# Altium project tinyCamera.PrjPcb
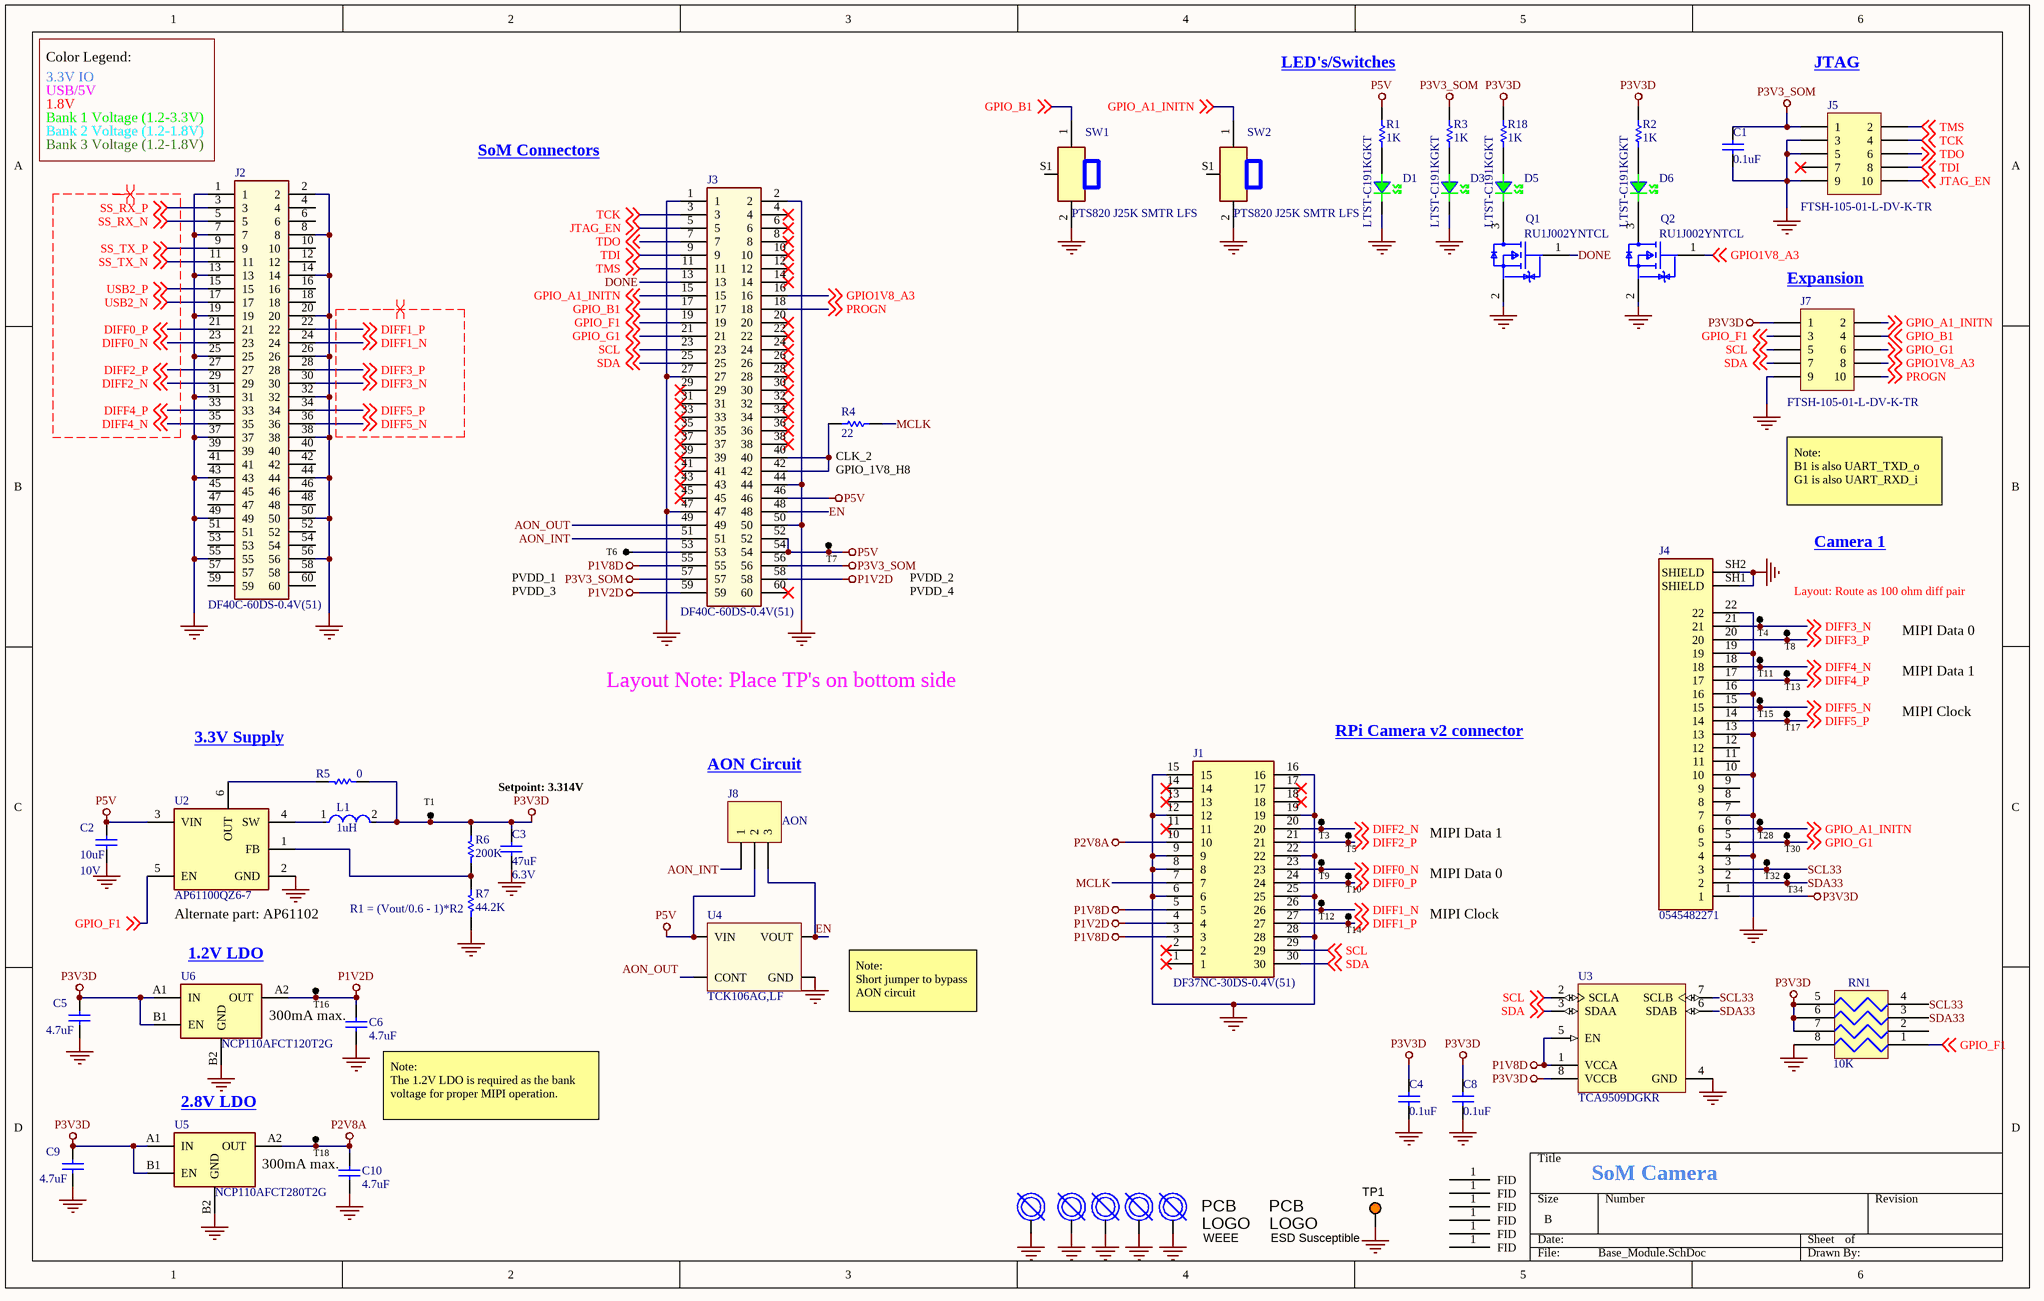
[diagram p0: Base_Module.SchDoc]
SCH_NAME: tinyCamera; REV: v2.0; PCB_NAME: tinyCamera
1 sheet, 74 parts. Net scope: global (net labels, ports and power ports of the same name join across sheets).
Board file: tinyCamera.PcbDoc

## Sheet Base_Module.SchDoc
size B; SheetNumber: 1; SheetTotal: 2

### Parts
BH1  STANDOFF M2.5  [MH_Standoff_WE9774010151R]  (value not drawn)  (no BOM)
BH2  STANDOFF M2.5  [MH_Standoff_WE9774010151R]  (value not drawn)  (no BOM)
BH3  STANDOFF M2.5  [MH_Standoff_WE9774010151R]  (value not drawn)  (no BOM)
BH4  STANDOFF M2.5  [MH_Standoff_WE9774010151R]  (value not drawn)  (no BOM)
BH5  STANDOFF M2.5  [MH_3MM]  (value not drawn)  (no BOM)
C1  0.1uF  [CAPC1005X55USR]
C2  10uF  Voltage: 10V  [CAP_0603]
C3  47uF  Voltage: 6.3V  [CAP_0603]
C4  0.1uF  [CAPC1005X55USR]
C5  4.7uF  [CAPC1005X55USR]
C6  4.7uF  [CAPC1005X55USR]
C8  0.1uF  [CAPC1005X55USR]
C9  4.7uF  [CAPC1005X55USR]
C10  4.7uF  [CAPC1005X55USR]
D1  LTST-C191KGKT  [LED_0603]
D3  LTST-C191KGKT  [LED_0603]
D5  LTST-C191KGKT  [LED_0603]
D6  LTST-C191KGKT  [LED_0603]
FID1  (no value)  [FID_040]  (no BOM)
FID2  (no value)  [FID_040]  (no BOM)
FID3  (no value)  [FID_040]  (no BOM)
FID4  (no value)  [FID_040]  (no BOM)
FID5  (no value)  [FID_040]  (no BOM)
FID6  (no value)  [FID_040]  (no BOM)
J1  DF37NC-30DS-0.4V(51)  [HRS_DF37NC-30DS-0.4V(51)]
J2  DF40C-60DS-0.4V(51)  [DF40C60DS04V51]
J3  DF40C-60DS-0.4V(51)  [DF40C60DS04V51]
J4  0545482271  [MOLEX_54548-2271]
J5  FTSH-105-01-L-DV-K-TR  [FTSH-105-01-XXX-DV-K]
J7  FTSH-105-01-L-DV-K-TR  [FTSH-105-01-XXX-DV-K]
J8  AON  [HDR1X3]
L1  1uH  [INDC2016X100N]
Logo1  WEEE  [WEEE_Minimum]  (no BOM)
Logo2  ESD Susceptible  [ESD_Overlay_Medium]  (no BOM)
Q1  RU1J002YNTCL  [SOT-323FL]
Q2  RU1J002YNTCL  [SOT-323FL]
R1  1K  [RESC1005X40USR]
R2  1K  [RESC1005X40USR]
R3  1K  [RESC1005X40USR]
R4  22  [RESC1005X40USR]
R5  0  [RESC1005X40USR]
R6  200K  [RESC1005X40USR]
R7  44.2K  [RESC1005X40USR]
R18  1K  [RESC1005X40USR]
RN1  10K  [RESCAXS50P100X200X45-8NA]
SW1  PTS820 J25K SMTR LFS  [PTS820J25MSMTRLFS]
SW2  PTS820 J25K SMTR LFS  [PTS820J25MSMTRLFS]
T1  3V3  [TP 1mm]  (value not drawn)  (no BOM)
T3  TP_S  [TP 20mil]  (value not drawn)  (no BOM)
T4  TP_S  [TP 20mil]  (value not drawn)  (no BOM)
T5  TP_S  [TP 20mil]  (value not drawn)  (no BOM)
T6  TP_S  [TP 20mil]  (value not drawn)  (no BOM)
T7  TP_S  [TP 20mil]  (value not drawn)  (no BOM)
T8  TP_S  [TP 20mil]  (value not drawn)  (no BOM)
T9  TP_S  [TP 20mil]  (value not drawn)  (no BOM)
T10  TP_S  [TP 20mil]  (value not drawn)  (no BOM)
T11  TP_S  [TP 20mil]  (value not drawn)  (no BOM)
T12  TP_S  [TP 20mil]  (value not drawn)  (no BOM)
T13  TP_S  [TP 20mil]  (value not drawn)  (no BOM)
T14  TP_S  [TP 20mil]  (value not drawn)  (no BOM)
T15  TP_S  [TP 20mil]  (value not drawn)  (no BOM)
T16  TP_S  [TP 20mil]  (value not drawn)  (no BOM)
T17  TP_S  [TP 20mil]  (value not drawn)  (no BOM)
T18  TP_S  [TP 20mil]  (value not drawn)  (no BOM)
T28  TP_S  [TP 20mil]  (value not drawn)  (no BOM)
T30  TP_S  [TP 20mil]  (value not drawn)  (no BOM)
T32  TP_S  [TP 1mm]  (value not drawn)  (no BOM)
T34  TP_S  [TP 1mm]  (value not drawn)  (no BOM)
TP1  5019  [TP380X203]  (value not drawn)
U2  AP61100QZ6-7  [SOTFL50P160X60-6N]
U3  TCA9509DGKR  [SOP65P490X110-8N]
U4  TCK106AG,LF  [WCSP4D]
U5  NCP110AFCT280T2G  [WLCSP4_P6XP6_ONS]
U6  NCP110AFCT120T2G  [WLCSP4_P6XP6_ONS]

### Nets
GND: BH1.1 BH2.1 BH3.1 BH4.1 BH5.1 C1.1 C2.1 C3.1 C4.1 C5.1 C6.1 C8.1 C9.1 C10.1 D1.2(K) D3.2(K) J1.6 J1.8 J1.9 J1.12 J1.15 J1.16 J1.19 J1.22 J1.25 J1.28 J2.1 J2.2 J2.7 J2.8 J2.13 J2.14 J2.19 J2.20 J2.25 J2.26 J2.31 J2.32 J2.37 J2.38 J2.43 J2.44 J2.49 J2.50 J2.55 J2.56 J3.1 J3.2 J3.27 J3.44 J3.47 J3.50 J4.4 J4.7 J4.10 J4.13 J4.16 J4.19 J4.22 J4.SH1(SHIELD) J4.SH2(SHIELD) J5.3 J5.5 J5.9 J7.9 Q1.2(S) Q2.2(S) R7.1 RN1.8 SW1.2 SW2.2 TP1.1 U2.2(GND) U3.4(GND) U4.B1(GND) U5.B2(GND) U6.B2(GND)
P1V2D: C6.2 J1.4 J3.58 J3.59 T16.1 U6.A2(OUT)
P1V8D: J1.3 J1.5 J3.55 U3.1(VCCA) U3.5(EN)
P2V8A: C10.2 J1.10 T18.1 U5.A2(OUT)
P3V3_SOM: C1.2 J3.56 J3.57 J5.1 R3.1
P3V3D: C3.2 C4.2 C5.2 C8.2 C9.2 J4.1 J7.1 L1.2 R2.1 R5.1 R6.2 R18.1 RN1.5 RN1.6 RN1.7 T1.1 U3.8(VCCB) U5.A1(IN) U5.B1(EN) U6.A1(IN) U6.B1(EN)
P5V: C2.2 J3.46 J3.52 J3.54 J8.2 R1.1 T7.1 U2.3(VIN) U4.A2(VIN)
AON_INT: J3.51 J8.1
AON_OUT: J3.49 U4.B2(CONT)
DIFF0_N: J1.23 J2.23 T9.1 ; off-sheet DIFF0_N
DIFF0_P: J1.24 J2.21 T10.1 ; off-sheet DIFF0_P
DIFF1_N: J1.26 J2.24 T12.1 ; off-sheet DIFF1_N
DIFF1_P: J1.27 J2.22 T14.1 ; off-sheet DIFF1_P
DIFF2_N: J1.20 J2.29 T3.1 ; off-sheet DIFF2_N
DIFF2_P: J1.21 J2.27 T5.1 ; off-sheet DIFF2_P
DIFF3_N: J2.30 J4.21 T4.1 ; off-sheet DIFF3_N
DIFF3_P: J2.28 J4.20 T8.1 ; off-sheet DIFF3_P
DIFF4_N: J2.35 J4.18 T11.1 ; off-sheet DIFF4_N
DIFF4_P: J2.33 J4.17 T13.1 ; off-sheet DIFF4_P
DIFF5_N: J2.36 J4.15 T15.1 ; off-sheet DIFF5_N
DIFF5_P: J2.34 J4.14 T17.1 ; off-sheet DIFF5_P
DONE: J3.13 Q1.1(G)
EN: J3.48 J8.3 U4.A1(VOUT)
GPIO1V8_A3: J3.16 J7.8 Q2.1(G) ; off-sheet GPIO1V8_A3
GPIO_A1_INITN: J3.15 J4.6 J7.2 SW2.1 T28.1 ; off-sheet GPIO_A1_INITN
GPIO_B1: J3.17 J7.4 SW1.1 ; off-sheet GPIO_B1
GPIO_F1: J3.19 J7.3 RN1.1 U2.5(EN) ; off-sheet GPIO_F1
GPIO_G1: J3.21 J4.5 J7.6 T30.1 ; off-sheet GPIO_G1
JTAG_EN: J3.5 J5.10 ; off-sheet JTAG_EN
MCLK: J1.7 R4.2
PROGN: J3.18 J7.10 ; off-sheet PROGN
SCL: J1.29 J3.23 J7.5 U3.2(SCLA) ; off-sheet SCL
SCL33: J4.3 RN1.4 T32.1 U3.7(SCLB)
SDA: J1.30 J3.25 J7.7 U3.3(SDAA) ; off-sheet SDA
SDA33: J4.2 RN1.3 T34.1 U3.6(SDAB)
SS_RX_N: J2.5 ; off-sheet SS_RX_N
SS_RX_P: J2.3 ; off-sheet SS_RX_P
SS_TX_N: J2.11 ; off-sheet SS_TX_N
SS_TX_P: J2.9 ; off-sheet SS_TX_P
TCK: J3.3 J5.4 ; off-sheet TCK
TDI: J3.9 J5.8 ; off-sheet TDI
TDO: J3.7 J5.6 ; off-sheet TDO
TMS: J3.11 J5.2 ; off-sheet TMS
USB2_N: J2.17 ; off-sheet USB2_N
USB2_P: J2.15 ; off-sheet USB2_P
NetD1_1: D1.1(A) R1.2
NetD3_1: D3.1(A) R3.2
NetD5_1: D5.1(A) R18.2
NetD5_2: D5.2(K) Q1.3(D)
NetD6_1: D6.1(A) R2.2
NetD6_2: D6.2(K) Q2.3(D)
NetJ3_40: J3.40 J3.42 R4.1
NetJ3_53: J3.53 T6.1
NetL1_1: L1.1 U2.4(SW)
NetR5_2: R5.2 U2.6(OUT)
NetR6_1: R6.1 R7.2 U2.1(FB)

Not connected (* = marked no-connect by the designer): FID1 1(FID); FID2 1(FID); FID3 1(FID); FID4 1(FID); FID5 1(FID); FID6 1(FID); J1 1* 2* 11* 13* 14* 17* 18*; J2 4 6 10 12 16 18 39 40 41 42 45 46 47 48 51 52 53 54 57 58 59 60; J3 4* 6* 8* 10* 12* 14* 20* 22* 24* 26* 28* 29* 30* 31* 32* 33* 34* 35* 36* 37* 38* 39* 41* 43* 45* 60*; J4 8 9 11 12; J5 7*; RN1 2; SW1 S1(GND); SW2 S1(GND)

### Layout directives
differential pair: DIFF0_N, DIFF0_P, DIFF1_N, DIFF1_P, DIFF2_N, DIFF2_P, DIFF3_N, DIFF3_P, DIFF4_N, DIFF4_P, DIFF5_N, DIFF5_P, SS_RX_N, SS_RX_P, SS_TX_N, SS_TX_P, USB2_N, USB2_P

### Notes on the sheet
- 3.3V IO
- USB/5V
- Color Legend:
- LED's/Switches
- JTAG
- 1.8V
- Bank 2 Voltage (1.2-1.8V)
- Bank 1 Voltage (1.2-3.3V)
- (near J2) Bank 3 Voltage (1.2-1.8V)
- SoM Connectors
- (near J7) Expansion
- (near R4) GPIO_1V8_H8
- (near R4) CLK_2
- Note:
  B1 is also UART_TXD_o
  G1 is also UART_RXD_i
- (near J4) Camera 1
- PVDD_3
- PVDD_1
- PVDD_2
- PVDD_4
- Layout: Route as 100 ohm diff pair
- MIPI Data 0
- Layout Note: Place TP's on bottom side
- MIPI Data 1
- 3.3V Supply
- AON Circuit
- (near J1) RPi Camera v2 connector
- MIPI Clock
- Setpoint: 3.314V
- (near R7) R1 = (Vout/0.6 - 1)*R2
- (near U2) Alternate part: AP61102
- (near U6) 1.2V LDO
- (near U6) 300mA max.
- (near U4) Note:
  Short jumper to bypass AON circuit
- (near U5) 2.8V LDO
- (near U5) 300mA max.
- (near C6) Note:
  The 1.2V LDO is required as the bank voltage for proper MIPI operation.
- SoM Camera
- (in symbol Logo ESD) PCB; LOGO
- (in symbol Logo WEEE) PCB; LOGO

### Library data of the parts
BH1-BH4 = MOUNT_HOLE: RND STANDOFF M2.5X0.45 STEEL 1MM; Manufacturer: Wurth Electronics; Manufacturer Part Number: 9774010151R; Plating: Tin; Threaded/Unthreaded: Threaded; Outside Diameter: 0.201inch; Supplier 1: Digi-Key; Supplier Part Number 1: 732-7064-1-ND; RoHS: Yes; Category: Spacers, Standoffs; Stock: 9107; Pricing: 1=1.16000, 10=1.09800, 50=0.97900, 100=0.89500, 500=0.83500 (USD); Material: Steel; Series: WA-SMSI; Length: 0.095inch; ComponentLink1URL: http://www.farnell.com/datasheets/2305577.pdf?src-supplier=Farnell; ComponentLink1Description: http://www.farnell.com/datasheets/2305577.pdf?src-supplier=Farnell; ComponentLink2URL: https://media.digikey.com/pdf/Data%20Sheets/Wurth%20Electronics%20PDFs/WA-SMSx_Performance_Flyer.pdf?src-supplier=Digi-Key; ComponentLink2Description: https://media.digikey.com/pdf/Data%20Sheets/Wurth%20Electronics%20PDFs/WA-SMSx_Performance_Flyer.pdf?src-supplier=Digi-Key; ComponentLink3URL: http://www.mouser.com/ds/2/445/9774010151R-611442.pdf?src-supplier=Mouser; ComponentLink3Description: http://www.mouser.com/ds/2/445/9774010151R-611442.pdf?src-supplier=Mouser; ComponentLink4URL: http://www.farnell.com/datasheets/2305577.pdf?src-supplier=Newark; ComponentLink4Description: http://www.farnell.com/datasheets/2305577.pdf?src-supplier=Newark; ComponentLink5URL: http://www.farnell.com/datasheets/2305577.pdf?src-supplier=Element14; ComponentLink5Description: http://www.farnell.com/datasheets/2305577.pdf?src-supplier=Element14
BH5 = MOUNT_HOLE: ROUND STANDOFF M2X0.4 STEEL 1MM
C1 C4 C8 = CAP CER 0.1UF 16V X7R 0402: Manufacturer Part Number: CGA2B1X7R1C104K050BC; Manufacturer: TDK Corporation; Supplier Part Number 1: 445-5613-2-ND; Package: 0402; Height: 0.55mm; Supplier 1: Digi-Key; value: 0.1uF
C2 = Cap_1uF_X5R_10%_6V3_0402: CAP CER 10uF 10V X5R 0603; Manufacturer Part Number: GRM188R61A106ME69D; Manufacturer: Murata Electronics; Supplier Part Number 1: 490-10475-1-ND; Package: 0603; value: 10uF; Supplier 1: Digi-Key; Height: 0.95mm; ComponentLink1Description: New link; ComponentLink1URL: *
C3 = Cap_1uF_X5R_10%_6V3_0402: CAP CER 47UF 6.3V X5R 0603; Manufacturer Part Number: GRM188R60J476ME15D; Manufacturer: Murata Electronics; Supplier Part Number 1: 490-13247-1-ND; Package: 0603; value: 47uF; Supplier 1: Digi-Key; Height: 1.0mm; ComponentLink1Description: New link; ComponentLink1URL: *
C5 C6 C9 C10 = CAP CER 4.7UF 10V X5R 0402: Manufacturer Part Number: C1005X5R1A475M050BC; Manufacturer: TDK Corporation; Supplier Part Number 1: 445-8023-1-ND; Package: 0402; value: 4.7uF; Supplier 1: Digi-Key; Height: 0.55mm; ComponentLink1Description: New link; ComponentLink1URL: *
D1 D3 D5 D6 = 0603LED_GRN: LED GREEN CLEAR CHIP 0603 SMD; Manufacturer: Lite-On Inc.; Manufacturer Part Number: LTST-C191GKT; Unit Cost, Qty 1: $0.68; Unit Cost, Qty 500: $0.293; Supplier Part Number 1: 160-1443-1-ND; Value: LTST-C191KGKT; Supplier 1: Digi-Key
FID1-FID6 = FID: Notes: DNP
J1 = DF37NC-30DS-0.4V(51): Conn Stacking RCP 30 POS 0.98mm Stack Height 0.4mm Solder ST SMD Emboss T/R; Manufacturer: Hirose; Voltage Rating: 30V; Current Rating: 300mA; Number of Positions: 30; Insulation Resistance: 50MR; Connector Type: Receptacle; Manufacturer Part Number: DF37NC-30DS-0.4V(51); Supplier 1: Digi-Key; Supplier Part Number 1: H11856CT-ND; RoHS: Yes; Category: Connectors; Stock: 2921; Pricing: 1=1.08000, 10=0.91600, 25=0.87800, 50=0.85960, 100=0.82210, 250=0.74740, 500=0.67266, 1000=0.59792, 2500=0.54186 (USD); Mounting Technology: Surface Mount; Contact Material: Bronze; Contact Plating: Gold; Min Operating Temperature: -35°C; Max Operating Temperature: 85°C; Packaging: Tape and Reel; Package Quantity: 8000; Number of Rows: 2; Termination: SMD/SMT; Series: DF37; Pitch: 0.4mm; Mated Stacking Heights: 0.98mm; Lead Free: Lead Free; RoHS Compliant: Yes; ComponentLink1URL: http://www.mouser.com/ds/2/185/DF37_catalog-939311.pdf?src-supplier=Mouser; ComponentLink1Description: http://www.mouser.com/ds/2/185/DF37_catalog-939311.pdf?src-supplier=Mouser; ComponentLink2URL: https://www.hirose.com/product/document?clcode=CL0684-3008-1-53&amp;productname=DF37B-20DP-0.4V(53)&amp;series=DF37&amp;documenttype=Catalog&amp;lang=en&amp;documentid=D49052_en&src-supplier=Digi-Key; ComponentLink2Description: https://www.hirose.com/product/document?clcode=CL0684-3008-1-53&amp;productname=DF37B-20DP-0.4V(53)&amp;series=DF37&amp;documenttype=Catalog&amp;lang=en&amp;documentid=D49052_en&src-supplier=Digi-Key; ComponentLink3URL: https://www.hirose.com/product/en/download_file/key_name/DF37NC-30DS-0.4V%2851%29/category/Specification%20Sheet/doc_file_id/46745/?file_category_id=9&item_id=06843313551&is_series=&src-supplier=Digi-Key; ComponentLink3Description: https://www.hirose.com/product/en/download_file/key_name/DF37NC-30DS-0.4V%2851%29/category/Specification%20Sheet/doc_file_id/46745/?file_category_id=9&item_id=06843313551&is_series=&src-supplier=Digi-Key; ComponentLink4URL: https://datasheet.octopart.com/DF37NC-30DS-0.4V%2851%29-Hirose-datasheet-136945248.pdf?src-supplier=LKR; ComponentLink4Description: https://datasheet.octopart.com/DF37NC-30DS-0.4V%2851%29-Hirose-datasheet-136945248.pdf?src-supplier=LKR
J2 J3 = DF40C-60DS-0.4V(51): CONN RCPT 60POS SMD GOLD; Manufacturer: Hirose; Connector Type: Receptacle; Number of Positions: 60; Current Rating: 300mA; Voltage Rating: 30V; Pitch: 0.4mm; Mated Stacking Heights: 1.5mm; Manufacturer Part Number: DF40C-60DS-0.4V(51); RoHS: Yes; Category: Headers and Wire Housings; Stock: 11621; Pricing: 1=1.29000, 10=1.08900, 25=1.04440, 50=1.02220, 100=0.97770, 250=0.88880, 500=0.79992, 1000=0.71104, 2500=0.64438 (USD); Mounting Technology: Surface Mount; Contact Plating: Gold; Contact Material: Bronze; Housing Material: Polymer; Package Quantity: 5000; Number of Rows: 2; Packaging: Tape and Reel; Series: DF40; Termination: SMD/SMT; Number of Contacts: 60; Gender: Receptacle; RoHS Compliant: Yes; Lead Free: Lead Free; Reach SVHC Compliant: No; ComponentLink1URL: https://datasheet.ciiva.com/46408/1824826-46408909.pdf?src-supplier=Element14; ComponentLink1Description: https://datasheet.ciiva.com/46408/1824826-46408909.pdf?src-supplier=Element14; Supplier 1: Digi-Key; Supplier Part Number 1: 26-DF40C-60DS-0.4V(51)CT-ND
J4 = 54548-2271: CONN FFC BOTTOM 22POS 0.50MM R/A; Manufacturer: Molex; Manufacturer Part Number: 0545482271; Supplier Part Number 1: WM8828CT-ND; Package: None; Supplier 1: Digi-Key; Value: *
J5 J7 = HDR2X5_1.27mm: CONN HEADER SMD 10POS 1.27MM; Manufacturer: Samtec Inc.; Max Current Rating: 1.75A; Number of Contacts: 10; Gender: Male; Connector Type: Male Pin; Row Spacing: 0.05inch; Supplier 1: Digi-Key; Supplier Part Number 1: SAM13165CT-ND; Manufacturer Part Number: FTSH-105-01-L-DV-K-TR; RoHS: Yes; Category: Headers and Wire Housings; Stock 1: 18878; Pricing 1: 1=4.28000, 10=3.88500, 100=3.42300 (USD); Mount: Surface Mount; Contact Plating: Gold; Contact Material: Bronze; Housing Color: Black; Housing Material: Polymer; Color: Black; Min Operating Temperature: -55°C; Max Operating Temperature: 125°C; Number of Rows: 2; Packaging: Tape and Reel; Termination: Solder; Orientation: Straight; Package Quantity: 550; Number of Positions: 10; Current Rating: 1.75A; Series: FTSH; Contact Type: Male Pin; Length: 6.35mm; Pitch: 1.27mm; Depth: 3.43mm; Contact Mating Length: 0.12inch; Radiation Hardening: No; Lead Free: Lead Free; RoHS Compliant: Yes; REACH SVHC: No SVHC; ComponentLink1URL: https://datasheet.ciiva.com/10245/ftsh-mt-10245289.pdf?src-supplier=Avnet; ComponentLink1Description: https://datasheet.ciiva.com/10245/ftsh-mt-10245289.pdf?src-supplier=Avnet; ComponentLink2URL: https://datasheet.ciiva.com/739/ftsh-1xx-xx-xxx-dv-xxx-mkt-739005.pdf?src-supplier=Digi-Key; ComponentLink2Description: https://datasheet.ciiva.com/739/ftsh-1xx-xx-xxx-dv-xxx-mkt-739005.pdf?src-supplier=Digi-Key; ComponentLink3URL: https://datasheet.ciiva.com/23735/81359-23735917.pdf?src-supplier=Newark; ComponentLink3Description: https://datasheet.ciiva.com/23735/81359-23735917.pdf?src-supplier=Newark
J8 = Header 3: CONN HEADER VERT 3POS 2.54MM; Manufacturer: Wurth Electronics; Manufacturer Part Number: 61300311121; Number of Positions: 3; Gender: Male; Contact Resistance: 20mR; Current Rating: 3A; Operating Supply Voltage: 250V; Pitch: 0.1inch; Supplier 1: Digi-Key; Supplier Part Number 1: 732-5316-ND; RoHS: Yes; Category: Connectors; Stock: 232387; Pricing: 1=0.13000, 10=0.11300, 25=0.09400, 50=0.07900, 100=0.07100, 1000=0.06600 (USD); Mounting Technology: Through Hole; Contact Plating: Gold; Contact Material: Copper; Color: Black; Min Operating Temperature: -40°C; Max Operating Temperature: 105°C; Number of Rows: 1; Packaging: Bulk; Termination: Solder; Number of Contacts: 3; Series: WR-PHD; Contact Type: Male Pin; Orientation: 5495OrientationType; Voltage Rating: 250V; Height: 8.94mm; Contact Mating Length: 0.236inch; Lead Free: Lead Free; RoHS Compliant: Yes; Reach SVHC Compliant: Unknown; ComponentLink1URL: http://www.farnell.com/cad/1737268.pdf?src-supplier=Element14; ComponentLink1Description: http://www.farnell.com/cad/1737268.pdf?src-supplier=Element14; ComponentLink2URL: https://datasheet.octopart.com/61300311121-W%C3%BCrth-Elektronik-datasheet-21154836.pdf?src-supplier=Element14; ComponentLink2Description: https://datasheet.octopart.com/61300311121-W%C3%BCrth-Elektronik-datasheet-21154836.pdf?src-supplier=Element14; ComponentLink3URL: https://katalog.we-online.de/em/datasheet/6130xx11121.pdf?src-supplier=Digi-Key; ComponentLink3Description: https://katalog.we-online.de/em/datasheet/6130xx11121.pdf?src-supplier=Digi-Key
L1 = 725321dda6339637d4d059423bc1c3c: FIXED IND 1UH 2.7A 57 MOHM SMD; Manufacturer: Murata Electronics; Manufacturer Part Number: DFE201610E-1R0M=P2; Supplier Part Number 1: 490-18106-1-ND; value: 1uH
Logo1 = Logo WEEE: WEEE logo; Library Reference: WEEE logo; Lib Reference: WEEE logo; PartNumber: WEEE logo
Logo2 = Logo ESD: ESD Susceptible Symbol; Library Reference: Logo; SymbolCreator: a0412235; Lib Reference: ESD_Susceptible; Publisher: Texas Instruments; SymbolVersion: 2011-08-22; Published: 2009-03-03; LatestRevisionDate: 2017-07-06; PartNumber: ESD Susceptible
Q1 Q2 = 1926738d861a973c8d722c53ec8fd09: MOSFET N-CH 50V 0.2A UMT3F; Manufacturer: Rohm; Drain To Source Resistance: 1.6Ω; Depletion Mode: False; Continuous Drain Current: 200mA; Pulse Drain Current: 800mA; Turn On Delay Time: 5ns; Threshold Vgs Max: 0.8V; Rthja Max: 833°C/W; Max Forward Diode Voltage: 1.2V; Max Junction Temp: +150°C; Standoff Height: 0mm; Input Capacitace At Vds: 26pF @ 10V; Number Of Channels: 1; Power Dissipation: 150mW; Gate To Source Voltage: 8V; Turn Off Delay Time: 17ns; Threshold Vgs Min: 0.3V; Lead Free: Yes; Device Class L3: MOSFETs; Drain To Source Voltage: 50V; ComponentLink2URL: https://d1d2qsbl8m0m72.cloudfront.net/en/products/databook/datasheet/discrete/transistor/mosfet/ru1j002yn-e.pdf; RoHS: TRUE; Device Class L2: Transistors; Mouser Description: MOSFET 0.9V Drive Nch MOSFET; Category: Trans; Octopart: https://octopart.com/ru1j002yntcl-rohm-47197697; Temperature: to +150°C; Height: 1.05mm; Number Of N Channels: 1; Package: UMT3F; ComponentLink2Description: Datasheet; Automotive: No; Drain To Source Breakdown Voltage: 50V; Device Class L1: Discrete Semiconductors; Supplier Part Number 1: 755-RU1J002YNTCL; Manufacturer Part Number: RU1J002YNTCL; Supplier 1: Mouser
R1-R3 R18 = RES 1K OHM 1% 1/16W 0402: RES SMD 1K OHM 1% 1/16W 0402; Manufacturer: YAGEO; Manufacturer Part Number: RC0402FR-071KL; Supplier Part Number 1: 311-1.00KLRCT-ND; Package: 0402; Height: 0.4mm; Supplier 1: Digi-Key; value: 1K
R4 = RES 1K OHM 1% 1/16W 0402: RES 22 OHM 1% 1/16W 0402; Manufacturer: YAGEO; Manufacturer Part Number: RC0402FR-0722RL; Supplier Part Number 1: 311-22.0LRCT-ND; Package: 0402; Height: 0.4mm; Supplier 1: Digi-Key; value: 22
R5 = RES 0 OHM JUMPER 1/20W 0201: RES 0 OHM JUMPER 1/16W 0402; Manufacturer: Yageo; Manufacturer Part Number: RC0402JR-070RL; Supplier Part Number 1: 311-0.0JRCT-ND; Package: 0402; Height: 0.4mm; Supplier 1: Digi-Key; value: 0
R6 = Res_10K_1%_0402: RES SMD 200K OHM 1% 1/16W 0402; Manufacturer: Stackpole Electronics Inc; Manufacturer Part Number: RMCF0402FT200K; Supplier Part Number 1: RMCF0402FT200KTR-ND; Package: 0402; Height: 0.4mm; Supplier 1: Digi-Key; value: 200K
R7 = Res_10K_1%_0402: RES SMD 44.2K OHM 1% 1/16W 0402; Manufacturer: Yageo; Manufacturer Part Number: RC0402FR-0744K2L; Supplier Part Number 1: YAG3163TR-ND; Package: 0402; Height: 0.4mm; Supplier 1: Digi-Key; value: 44.2K
RN1 = RES ARRAY 4 RES 47K OHM 0804: Res Thick Film Array 10K Ohm 5% ±200ppm/°C ISOL 8-Pin 0804(4 X 0402) Convex SMD Automotive T/R; Manufacturer: Panasonic; Manufacturer Part Number: EXB-28V103JX; Number of Resistors: 4; Power Dissipation: 63mW; Voltage Rating: 50V; Circuit Type: Isolated; Power Per Element: 62.5mW; Number of Contacts: 8; Voltage Rating (DC): 100V; Supplier 1: Digi-Key; Supplier Part Number 1: Y7103CT-ND; RoHS: Yes; Category: Resistor Arrays; Stock: 1570078; Pricing: 1=0.10000, 10=0.08100, 25=0.05640, 50=0.04380, 100=0.03130, 250=0.02444, 500=0.01942, 1000=0.01378, 5000=0.01065 (USD); Mounting Technology: Surface Mount; Case/Package: 0804; Pins: 8; Case Code (Metric): 1005; Case Code (Imperial): 0402; Min Operating Temperature: -55°C; Max Operating Temperature: 125°C; Value: 10K; Packaging: Tape and Reel; Package Quantity: 1; Temperature Coefficient: 200ppm/°C; Series: EXB; Tolerance: 5%; Number of Elements: 4; Termination: Convex; Resistance Tolerance: 5%; Technology: THICK FILM; Length: 2mm; Width: 1mm; Height: 0.35mm; Depth: 1mm; Terminal Pitch: 0.5mm; Radiation Hardening: No; Lead Free: Lead Free; RoHS Compliant: Yes; Military Standard: Not; Reach SVHC Compliant: Unknown; ComponentLink1URL: https://datasheet.ciiva.com/46387/1480003-46387949.pdf?src-supplier=Element14; ComponentLink1Description: https://datasheet.ciiva.com/46387/1480003-46387949.pdf?src-supplier=Element14; ComponentLink2URL: https://datasheet.ciiva.com/46376/1480003-46376265.pdf?src-supplier=Element14; ComponentLink2Description: https://datasheet.ciiva.com/46376/1480003-46376265.pdf?src-supplier=Element14; ComponentLink3URL: https://datasheet.ciiva.com/28418/1790599-28418558.pdf?src-supplier=Element14; ComponentLink3Description: https://datasheet.ciiva.com/28418/1790599-28418558.pdf?src-supplier=Element14; ComponentLink4URL: https://datasheet.ciiva.com/28636/1790599-28636885.pdf?src-supplier=Element14; ComponentLink4Description: https://datasheet.ciiva.com/28636/1790599-28636885.pdf?src-supplier=Element14; ComponentLink5URL: https://datasheet.ciiva.com/30209/aoc0000ce1-30209125.pdf?src-supplier=Onlinecomponents.com; ComponentLink5Description: https://datasheet.ciiva.com/30209/aoc0000ce1-30209125.pdf?src-supplier=Onlinecomponents.com
SW1 SW2 = SPST_NO: SWITCH TACTILE SPST-NO 0.05A 12V; Manufacturer: C&K; Supplier Part Number 1: CKN10897CT-ND; Supplier 1: Digi-Key; Manufacturer Part Number: PTS820 J25K SMTR LFS
T1 T3-T18 T28 T30 T32 T34 = TP_S: test point
TP1 = 5019: PC TEST POINT MINIATURE; Manufacturer: Keystone Electronics; Supplier Part Number 1: 36-5019CT-ND; Manufacturer Part Number: 5019; ComponentLink2URL: http://keyelco.com/userAssets/file/M65p56.pdf; Supplier 1: Digi-Key; ComponentLink1Description: Manufacturer URL; ComponentLink1URL: http://www.keyelco.com/; ComponentLink2Description: Datasheet
U2 = AP61102Z6-7: DC-DC CONV LV BUCK SOT563; Manufacturer: Diodes Incorporated; Height: 0.6mm; Manufacturer Part Number: AP61100QZ6-7; Supplier 1: Digi-Key; Supplier Part Number 1: 31-AP61100QZ6-7TR-ND
U3 = TI-TCA9509-MSOP_DGK-8: Level-translating I2C And Smbus; Manufacturer: Texas Instruments; Min Supply Voltage: 900mV; Max Supply Voltage: 5.5V; Propagation Delay: 132.8ns; Clock Frequency: 400kHz; Number of Outputs: 2; Input: 2-Wire Bus; Number of Channels: 1; Operating Supply Current: 3mA; Supplier 1: Digi-Key; Supplier Part Number 1: 296-30283-1-ND; Manufacturer Part Number: TCA9509DGKR; RoHS: Yes; Category: Interface ICs; Stock: 68069; Pricing: 1=1.27000, 10=1.13200, 25=1.07480, 100=0.88270, 250=0.82516, 500=0.72922, 1000=0.57570 (USD); Case/Package: VSSOP; Pins: 8; Weight: 0.001058oz; Min Operating Temperature: -40°C; Max Operating Temperature: 85°C; Packaging: Tape and Reel; Series: -; Length: 3.1mm; Width: 3.1mm; Height: 0.95mm; Radiation Hardening: No; Reach SVHC Compliant: No; Lead Free: Lead Free; RoHS Compliant: Yes; ComponentLink1URL: https://datasheet.ciiva.com/22791/tca9509-22791264.pdf?src-supplier=Farnell; ComponentLink1Description: https://datasheet.ciiva.com/22791/tca9509-22791264.pdf?src-supplier=Farnell; ComponentLink2URL: https://datasheet.ciiva.com/3149/tca9509-3149522.pdf?src-supplier=Avnet; ComponentLink2Description: https://datasheet.ciiva.com/3149/tca9509-3149522.pdf?src-supplier=Avnet; ComponentLink3URL: https://datasheet.ciiva.com/26911/getdatasheetpartid-476504-26911504.pdf?src-supplier=Verical; ComponentLink3Description: https://datasheet.ciiva.com/26911/getdatasheetpartid-476504-26911504.pdf?src-supplier=Verical; ComponentLink4URL: https://datasheet.ciiva.com/41460/001187989-da-01-en-ic-i2c-bus-rep-l-tca9509dgkr-vssop-8-tid-41460370.pdf?src-supplier=Conrad; ComponentLink4Description: https://datasheet.ciiva.com/41460/001187989-da-01-en-ic-i2c-bus-rep-l-tca9509dgkr-vssop-8-tid-41460370.pdf?src-supplier=Conrad; ComponentLink5URL: https://datasheet.ciiva.com/1784/tca9509-1784225.pdf?src-supplier=Digi-Key; ComponentLink5Description: https://datasheet.ciiva.com/1784/tca9509-1784225.pdf?src-supplier=Digi-Key; ComponentLink6URL: https://datasheet.ciiva.com/1784/tca9509-1784226.pdf?src-supplier=Digi-Key; ComponentLink6Description: https://datasheet.ciiva.com/1784/tca9509-1784226.pdf?src-supplier=Digi-Key; ComponentLink7URL: https://datasheet.ciiva.com/1784/tca9509-1784227.pdf?src-supplier=Digi-Key; ComponentLink7Description: https://datasheet.ciiva.com/1784/tca9509-1784227.pdf?src-supplier=Digi-Key
U4 = TCK106AG: IC PWR SWITCH P-CHAN 1:1 4WCSPD; Vendor: Toshiba; Built_By: EMA_UL_Team; Number_devices_in_Package: 1; 1pc cost: $0.47; 100pc cost: $0.2349; Manufacturer Part Number: TCK106AG,LF; Copyright: Copyright (C) 2018 Accelerated Designs. All rights reserved; RefDes: RefDes; Type: DEV; Source_Package: TCK106AG; Supplier 1: Digi-Key; Manufacturer: Toshiba; Height: 0.55mm; Supplier Part Number 1: TCK106AGLFCT-ND
U5 = NCP110AFCT120T2G: LDO Regulator, 200 mA, Low Vin, Ultra-High PSRR 2.8V, Active Discharge; Manufacturer: ON Semiconductor; Output Type: Fixed; Output Configuration: Positive; Number of Regulators: 1; Max Supply Voltage: 5.5V; Output Current: 200mA; Quiescent Current: 25uA; Power Supply Rejection Ratio (PSRR): 55dB; Supplier 1: Mouser; Supplier Part Number 1: 863-NCP110AFCT280T2G; Manufacturer Part Number: NCP110AFCT280T2G; RoHS: Yes; Category: Voltage Regulators - Linear; Stock: 2308; Pricing: 1=0.45000, 10=0.35600, 50=0.35600, 100=0.20000, 1000=0.12500, 10000=0.10700 (USD); Mounting Technology: Surface Mount; Min Operating Temperature: -40°C; Max Operating Temperature: 125°C; Series: -; Packaging: Tape and Reel; Min Output Voltage: 2.8V; RoHS Compliant: Yes
U6 = NCP110AFCT120T2G: LDO Regulator, 200 mA, Low Vin, Ultra-High PSRR 1.2V, Active Discharge; Manufacturer: ON Semiconductor; Supplier 1: Digi-Key; Manufacturer Part Number: NCP110AFCT120T2G; RoHS: Yes; Category: Voltage Regulators - Linear; Stock 1: 4650; Pricing 1: 1=0.41000, 10=0.33100, 25=0.30280, 100=0.22520, 250=0.20412, 500=0.16892, 1000=0.12669, 2500=0.11613 (USD); RoHS Compliant: Yes; Supplier Part Number 1: 488-NCP110AFCT120T2GCT-ND

## Assembly variants
v2.0: all parts fitted